# EAGLE design INT_LTS (EAGLE 9.6.2)
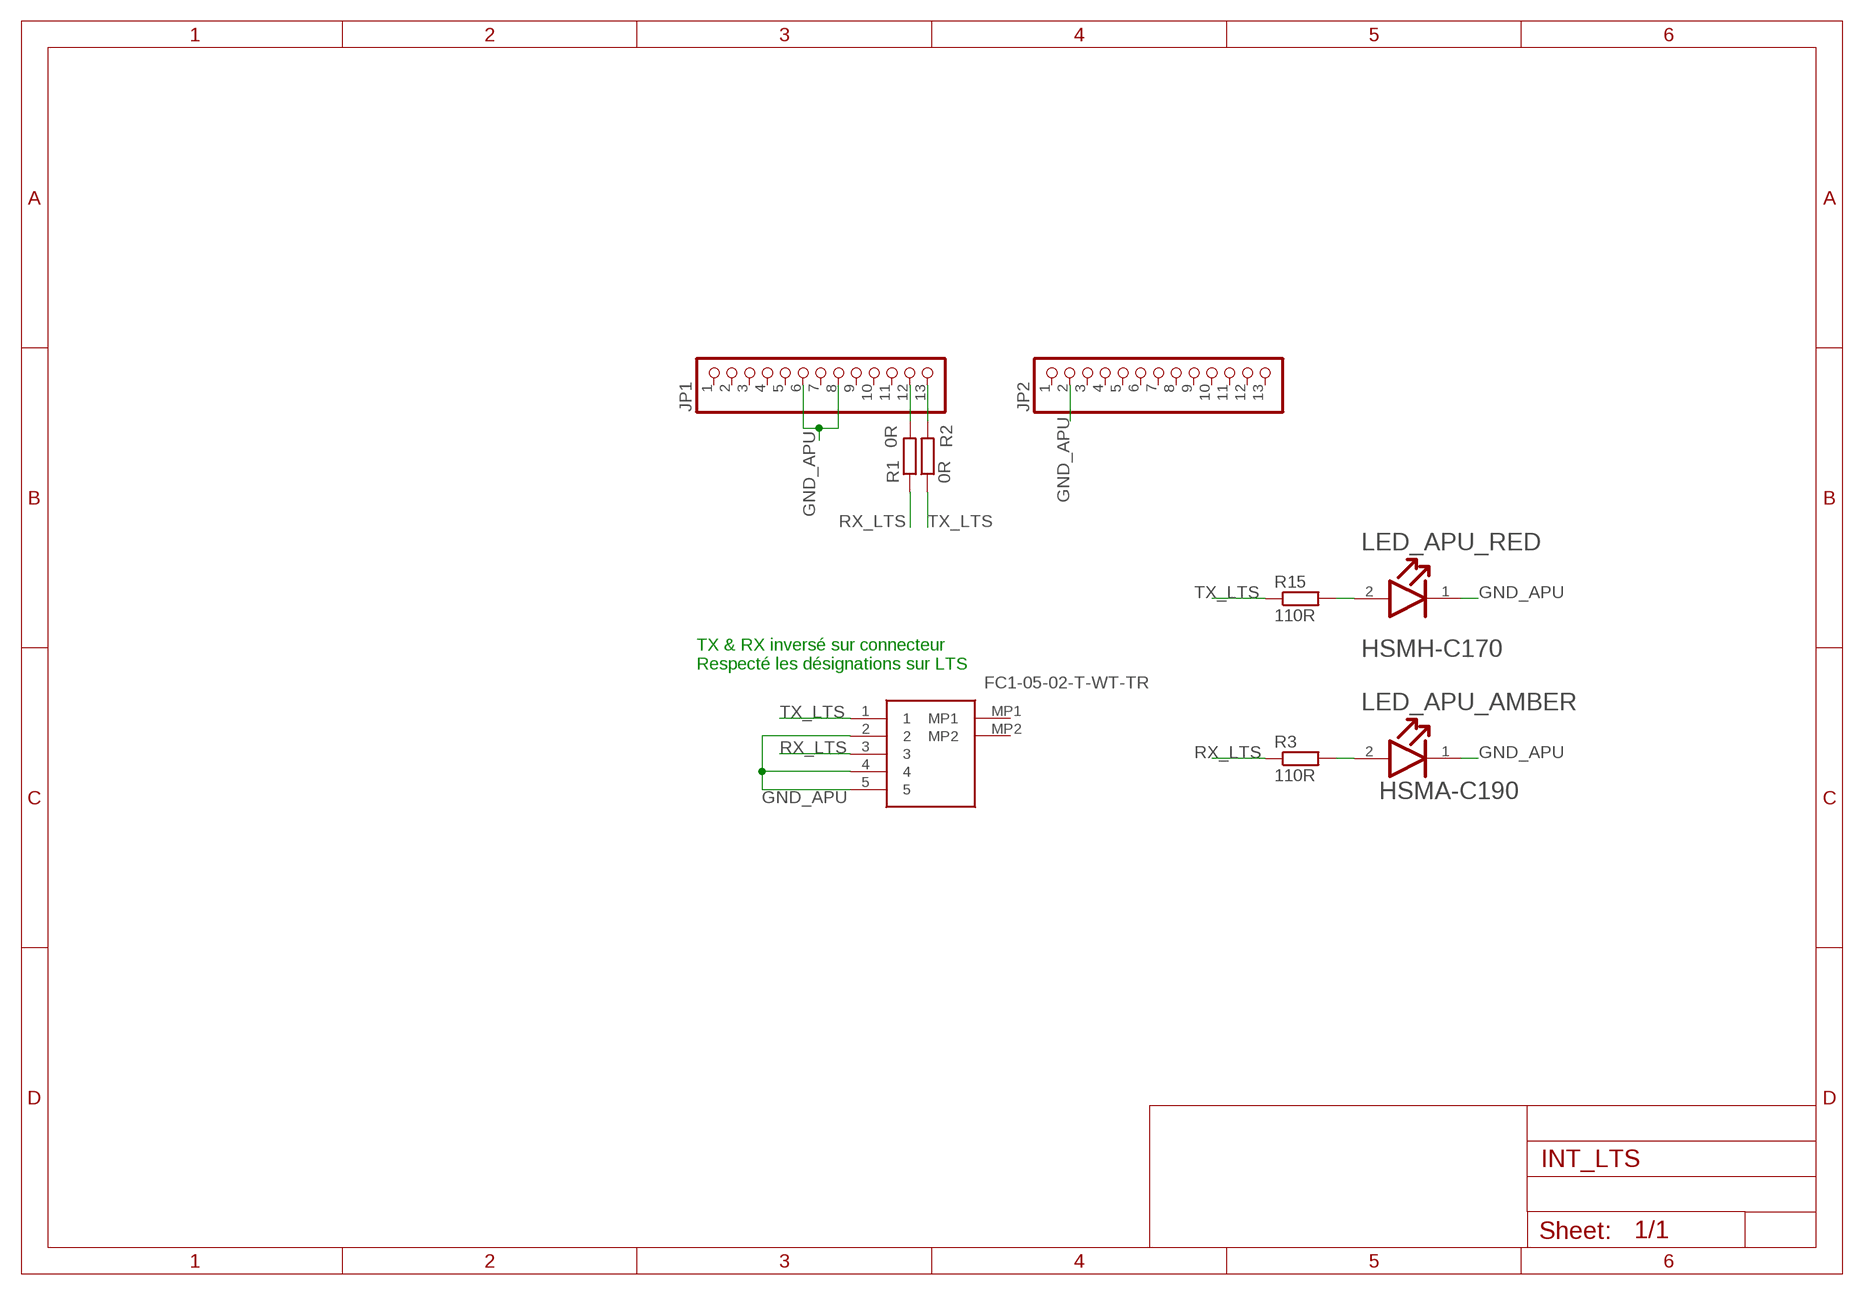
[diagram p0: schematic, sheet 1]

## Parts
J7  FC1-05-02-T-WT-TR  [FC10502TWTTR]
JP1  PINHD-1X13  [1X13]
JP2  PINHD-1X13  [1X13]
LED_APU_AMBER  BROADCOM_HSMA-C190BROADCOM_HSMA-C190_0_0  [BROADCOM_HSMA-C190_0]
LED_APU_RED  BROADCOM_HSMH-C170BROADCOM_HSMH-C170_0_0  [BROADCOM_HSMH-C170_0]
R1  0R  R-EU_R0603  [R0603]
R2  0R  R-EU_R0603  [R0603]
R3  110R  R-EU_R0603  [R0603]
R15  110R  R-EU_R0603  [R0603]

## Nets
GND_APU: J7.2 J7.4 J7.5 JP1.6 JP1.8 JP2.2 LED_APU_AMBER.1(CATHODE) LED_APU_RED.1(CATHODE)
N$1: JP1.12 R1.2
N$2: JP1.13 R2.2
N$3: LED_APU_AMBER.2(ANODE) R3.2
N$8: LED_APU_RED.2(ANODE) R15.2
RX_LTS: J7.3 R1.1 R3.1
TX_LTS: J7.1 R2.1 R15.1
Unconnected: J7.MP1 J7.MP2 JP1.1 JP1.2 JP1.3 JP1.4 JP1.5 JP1.7 JP1.9 JP1.10 JP1.11 JP2.1 JP2.3 JP2.4 JP2.5 JP2.6 JP2.7 JP2.8 JP2.9 JP2.10 JP2.11 JP2.12 JP2.13

## Notes on the sheet
- TX & RX inversé sur connecteur
  Respecté les désignations sur LTS

## Library data of the parts
J7 = FC1-05-02-T-WT-TR:FC1-05-02-T-WT-TR: FFC & FPC Connectors 1.00 mm Flat Flexible Cable (FFC) Socket Strip Source: Datasheet <http://suddendocs.samtec.com/catalog_english/fc1.pdf>; DESCRIPTION: FFC & FPC Connectors 1.00 mm Flat Flexible Cable (FFC) Socket Strip; HEIGHT: 5.19mm; MANUFACTURER_NAME: SAMTEC; MANUFACTURER_PART_NUMBER: FC1-05-02-T-WT-TR; MOUSER_PART_NUMBER: 200-FC10502TWTTR; MOUSER_PRICE-STOCK: https://www.mouser.co.uk/ProductDetail/Samtec/FC1-05-02-T-WT-TR?qs=rU5fayqh%252BE0IHNLE7hd%252B7w%3D%3D
JP1 JP2 = pinhead:PINHD-1X13: PIN HEADER
LED_APU_AMBER = Broadcom - HSMA-C190:BROADCOM_HSMA-C190: Amber 592nm LED Indication - Discrete 1.9V 0603 (1608 Metric); AUTOMOTIVE: No; CENTROID_NOT_SPECIFIED: No; COLOUR: Amber; DATASHEET: https://docs.broadcom.com/doc/AV02-0112EN; DEVICE_CLASS_L1: Optoelectronics; DEVICE_CLASS_L2: LEDs; DEVICE_CLASS_L3: unset; DIGIKEY_DESCRIPTION: LED AMBER DIFFUSED CHIP SMD; DIGIKEY_PART_NUMBER: 516-1423-1-ND; FOOTPRINT_VARIANT_NAME_0: Recommended_Land_Pattern; FORWARD_CURRENT: 20mA; FORWARD_VOLTAGE: 1.9V; HEIGHT: 0.9mm; LEAD_FREE: Yes; LED_ORIENTATION: Top View; LUMINOUS_INTENSITY: 90mcd; MAX_JUNCTION_TEMP: +95°C; MF: Broadcom; MFG_PACKAGE_IDENT: 0; MFG_PACKAGE_IDENT_DATE: 0; MFG_PACKAGE_IDENT_REV: 0; MOUSER_DESCRIPTION: LED Uni-Color Amber 595nm 2-Pin Chip LED T/R; MOUSER_PART_NUMBER: 630-HSMA-C190; MPN: HSMA-C190; PACKAGE: 0603; PEAK_EMMISION_WAVELENGTH: 595nm; POWER_DISSIPATION: 60mW; PREFIX: D; REVERSE_VOLTAGE: 5V; ROHS: Yes; TEMPERATURE_RANGE_HIGH: +85°C; TEMPERATURE_RANGE_LOW: -40°C; VERIFICATION_VERSION: 0.0.0.3; VIEWING_ANGLE: 170°; VOLTAGE: 1.9V; WAVELENGTH: 592nm
LED_APU_RED = Broadcom - HSMH-C170:BROADCOM_HSMH-C170: LED RED DIFFUSED 0805 SMD; CENTROID_NOT_SPECIFIED: No; COLOUR: Red; DATASHEET: https://media.digikey.com/pdf/Data%20Sheets/Avago%20PDFs/HSMz-Czzz.pdf; DEVICE_CLASS_L1: Optoelectronics; DEVICE_CLASS_L2: LEDs; DEVICE_CLASS_L3: unset; DIGIKEY_DESCRIPTION: DIODE LED RED DIFFUSED 0805 SMD; DIGIKEY_PART_NUMBER: 516-1427-1-ND; FORWARD_CURRENT: 25mA; FORWARD_VOLTAGE: 1.8V; HEIGHT: 0.9mm; LEAD_FREE: yes; LED_ORIENTATION: Top View; LUMINOUS_INTENSITY: 17mcd; MAX_JUNCTION_TEMP: +95°C; MF: Broadcom; MFG_PACKAGE_IDENT: HSMH-C170; MFG_PACKAGE_IDENT_DATE: 0; MFG_PACKAGE_IDENT_REV: 0; MOUSER_PART_NUMBER: 630-HSMH-C170; MPN: HSMH-C170; PACKAGE: 0805 (2012 metric); POWER_DISSIPATION: 65mW; PREFIX: D; REVERSE_VOLTAGE: 5V; ROHS: yes; STANDOFF_HEIGHT: 0mm; TEMPERATURE_RANGE_HIGH: +85°C; TEMPERATURE_RANGE_LOW: -40°C; VERIFICATION_VERSION: 0.0.0.1; VIEWING_ANGLE: 170°; WAVELENGTH: 639nm
R1-R3 R15 = rcl:R-EU_: RESISTOR, European symbol; SPICEPREFIX: R

## Net classes
0 default: width 0.2 mm, clearance 0.127 mm
1 Power: width 0.4 mm, clearance 0.2 mm
2 50Ohms: width 0.147 mm, clearance 0.127 mm

## Board
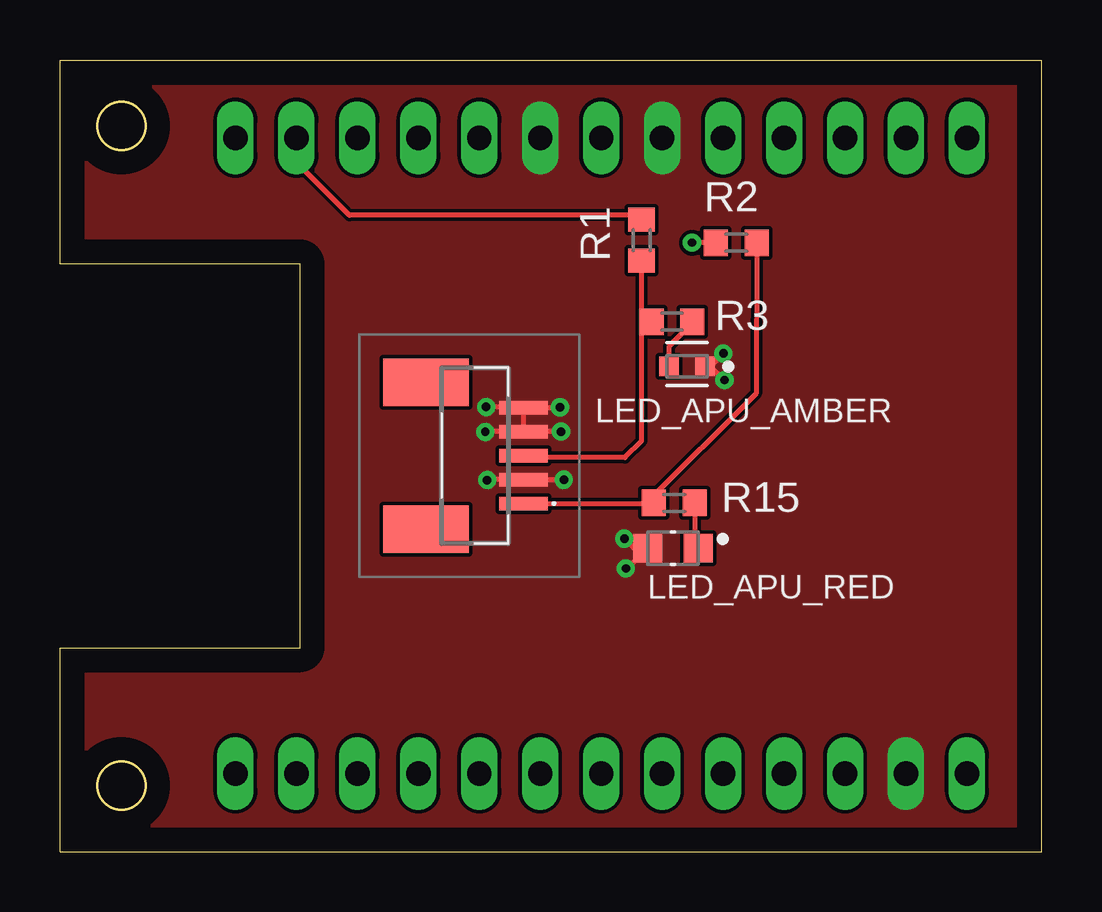
[diagram p1: board, top side]
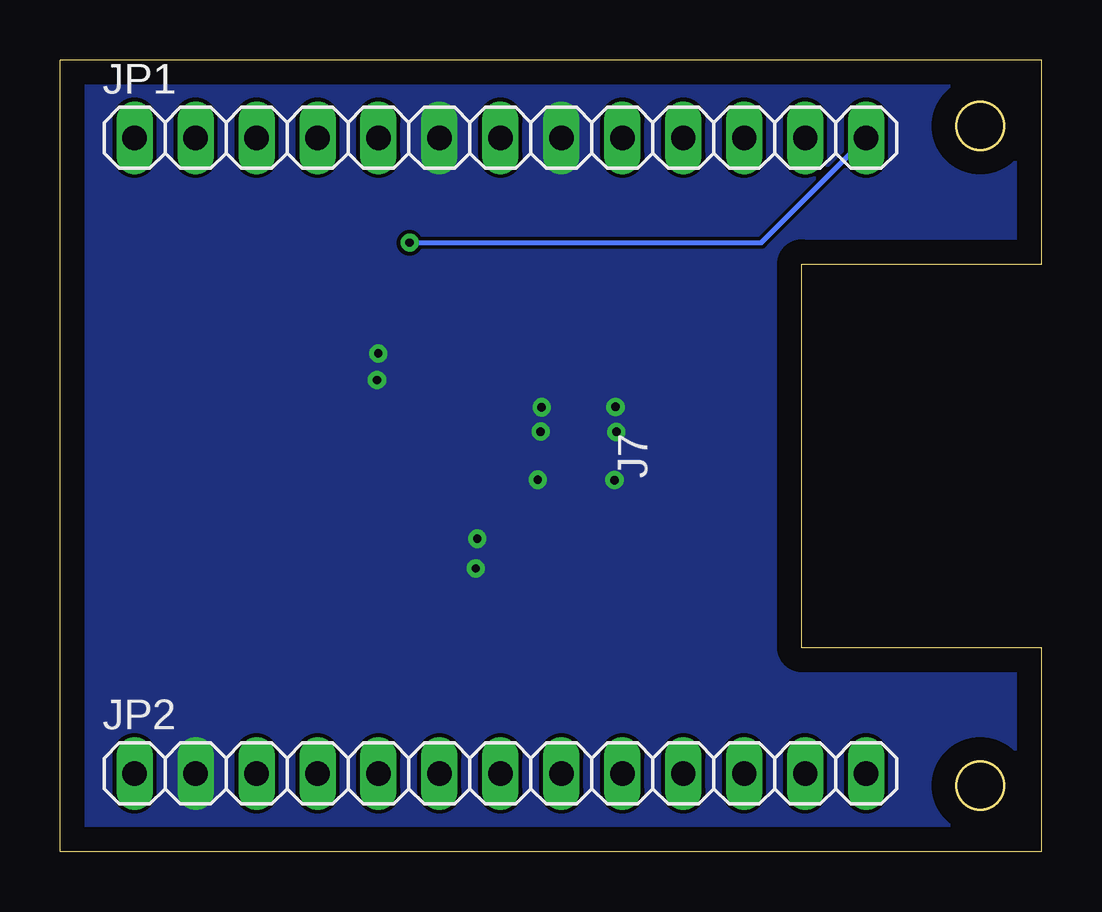
[diagram p2: board, bottom side, seen from below]

Size 40.9 x 33 mm. Coordinates in mm from the lower left corner, seen from the top.
Outline: 0,0 40.9,0 40.9,33 0,33 0,24.5 10,24.5 10,8.5 0,8.5 0,0
Outline: circle at 2.56,30.25 radius 1
Outline: circle at 2.56,2.75 radius 1
Copper layers (1*16): Top 0.035mm / dielectric 1.5mm / Bottom 0.035mm
Design rules "default": minimum track width 6mil, minimum drill 0.35mm, track to track 6mil, track to pad 6mil, pad to pad 6mil, via to via 6mil, smd to smd 6mil, copper to edge 40mil, drill to drill 6mil, minimum pad ring 10mil, minimum via ring 8mil, stop-mask expansion 4mil, vias tented up to drill 0mil, thermal gap 10mil

### Footprints (pad centres in the part's own frame; a part is rotated, then mirrored left to right if it is on the bottom)
FC10502TWTTR = smd 0.56 x 2.03: 1 -2,-2.033; 2 -1,-2.033; 3 0,-2.033; 4 1,-2.033; 5 2,-2.033 | smd 1.98 x 3.56: MP1 -3.06,2.033; MP2 3.06,2.033
1X13 = drill 1.016 long: 1 -15.24,0; 2 -12.7,0; 3 -10.16,0; 4 -7.62,0; 5 -5.08,0; 6 -2.54,0; 7 0,0; 8 2.54,0; 9 5.08,0; 10 7.62,0; 11 10.16,0; 12 12.7,0; 13 15.24,0
BROADCOM_HSMA-C190_0 = smd 0.8 x 0.8: 1 -0.75,0; 2 0.75,0
BROADCOM_HSMH-C170_0 = smd 1.2 x 1.2: 1 -1.05,0; 2 1.05,0
R0603 = smd 1 x 1.1: 1 -0.85,0; 2 0.85,0

### Placement (x,y rotation side)
J7  17.28,16.5 90 top
JP1  22.55,29.75 0 bottom
JP2  22.55,3.25 0 bottom
LED_APU_AMBER  26.12,20.23 180 top
LED_APU_RED  25.54,12.65 0 top
R1  24.23,25.49 90 top
R2  28.18,25.38 180 top
R3  25.5,22.09 0 top
R15  25.59,14.54 0 top

### Tracks (layer width: path | path; a pad name or v marks a point on that pad's centre or on a via)
GND_APU  (via drill 0.35)
  Top 0.2: v20.99,15.5 J7.2 17.82,15.5 v17.8,15.48 | J7.4 J7.5 | J7.5 19.33,18.52 v20.83,18.52 | J7.5 19.28,18.54 v17.76,18.54 | J7.4 19.34,17.53 20.85,17.53 v20.87,17.51 | J7.4 17.72,17.5 v17.72,17.49 | v23.51,13.04 23.91,12.65 LED_APU_RED.1 23.64,11.8 v23.58,11.8 | v27.64,20.77 27.1,20.23 LED_APU_AMBER.1 27.12,20.23 v27.69,19.66
  pour Top (no thermals): -6.31,-4.92 -6.19,-5.04 47.43,-5.04 47.56,-4.92 47.56,37.77 -6.23,37.77 -6.29,37.7 -6.29,35.87
  pour Bottom (no thermals): -6.32,-4.89 -6.1,-5.11 47.41,-5.11 47.54,-4.97 47.54,37.72 -6.24,37.72 -6.31,37.65 -6.31,35.82
N$1
  Top 0.2: R1.2 24.04,26.53 12.06,26.53 9.85,28.74 JP1.12
N$2  (via drill 0.35)
  Top 0.2: R2.2 v26.33,25.38
  Bottom 0.2: v26.33,25.38 11.68,25.38 JP1.13
N$3
  Top 0.2: R3.2 26.35,22.03 25.37,21.05 LED_APU_AMBER.2
N$8
  Top 0.2: R15.2 26.44,12.8 LED_APU_RED.2
RX_LTS
  Top 0.2: J7.3 19.39,16.43 23.54,16.43 24.23,17.12 24.23,20.86 24.23,21.67 | 24.23,21.67 R1.1 | 24.23,21.67 R3.1
TX_LTS
  Top 0.2: J7.1 24.41,14.5 | 24.41,14.5 24.71,14.5 R15.1 | R2.1 29,19.1 24.41,14.5